# Altium project 24bit_ADC_ADS1234.PrjPcb
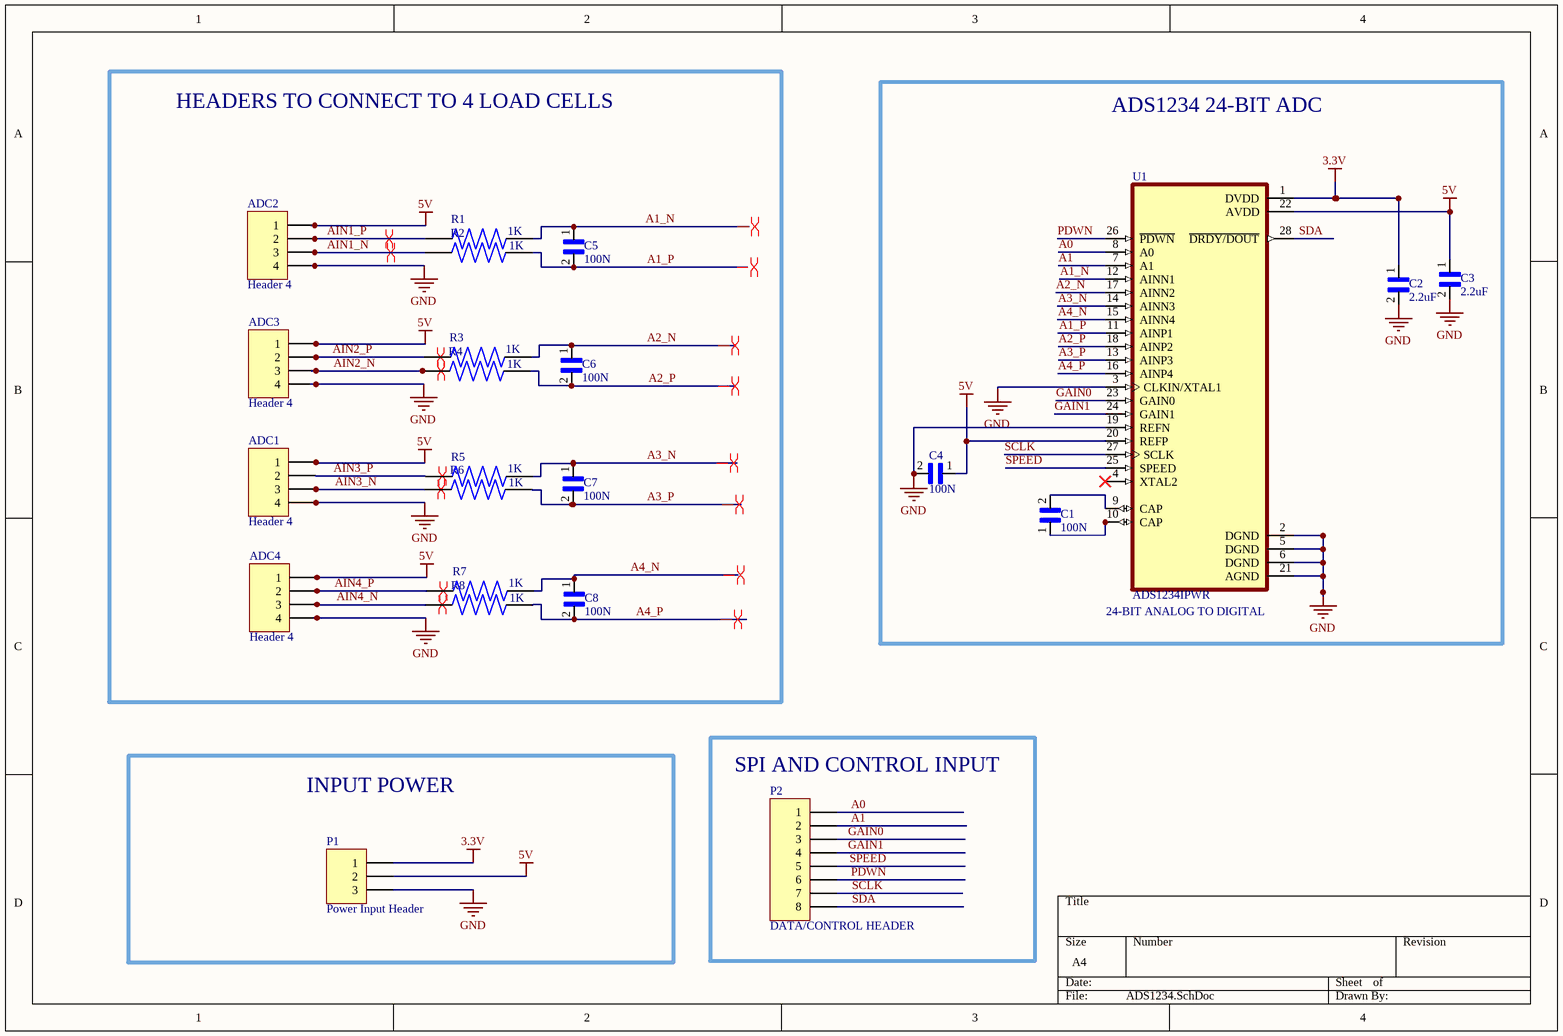
[diagram p0: ADS1234.SchDoc]
1 sheet, 23 parts. Net scope: global (net labels, ports and power ports of the same name join across sheets).
Board file: ADS1234.PcbDoc

## Sheet ADS1234.SchDoc
size A4; SheetNumber: 1; SheetTotal: 1

### Parts
ADC1  Header 4  [HDR1X4]
ADC2  Header 4  [HDR1X4]
ADC3  Header 4  [HDR1X4]
ADC4  Header 4  [HDR1X4]
C1  100N  [CAPC1005X55N]
C2  2.2uF  [CAPC1608X100N]
C3  2.2uF  [CAPC1608X100N]
C4  100N  [CAPC1005X55N]
C5  100N  [CAPC1005X55N]
C6  100N  [CAPC1005X55N]
C7  100N  [CAPC1005X55N]
C8  100N  [CAPC1005X55N]
P1  Power Input Header  [HDR1X3]
P2  DATA/CONTROL HEADER  [HDR1X8]
R1  1K  [RESC2012X50N]
R2  1K  [RESC2012X50N]
R3  1K  [RESC2012X50N]
R4  1K  [RESC2012X50N]
R5  1K  [RESC2012X50N]
R6  1K  [RESC2012X50N]
R7  1K  [RESC2012X50N]
R8  1K  [RESC2012X50N]
U1  ADS1234IPWR  [SOP65P640X120-28N]

### Blocks framed on the sheet
HEADERS TO CONNECT TO 4 LOAD CELLS: ADC1-ADC4 C5-C8 R1-R8
ADS1234 24-BIT ADC: C1-C4 U1
INPUT POWER: P1
SPI AND CONTROL INPUT: P2

### Nets
3.3V: C2.1 P1.1 U1.1(DVDD)
5V: ADC1.1 ADC2.1 ADC3.1 ADC4.1 C3.1 C4.1 P1.2 U1.20(REFP) U1.22(AVDD)
GND: ADC1.4 ADC2.4 ADC3.4 ADC4.4 C2.2 C3.2 C4.2 P1.3 U1.2(DGND) U1.3(CLKIN/XTAL1) U1.5(DGND) U1.6(DGND) U1.19(REFN) U1.21(AGND)
A0: P2.1 U1.8(A0)
A1: P2.2 U1.7(A1)
A1_N: C5.1 R1.2 U1.12(AINN1)
A1_P: C5.2 R2.2 U1.11(AINP1)
A2_N: C6.1 R3.2 U1.17(AINN2)
A2_P: C6.2 R4.2 U1.18(AINP2)
A3_N: C7.1 R5.2 U1.14(AINN3)
A3_P: C7.2 R6.2 U1.13(AINP3)
A4_N: C8.1 R7.2 U1.15(AINN4)
A4_P: C8.2 R8.2 U1.16(AINP4)
AIN1_N: ADC2.3 R2.1
AIN1_P: ADC2.2 R1.1
AIN2_N: ADC3.3 R4.1
AIN2_P: ADC3.2 R3.1
AIN3_N: ADC1.3 R6.1
AIN3_P: ADC1.2 R5.1
AIN4_N: ADC4.3 R8.1
AIN4_P: ADC4.2 R7.1
GAIN0: P2.3 U1.23(GAIN0)
GAIN1: P2.4 U1.24(GAIN1)
PDWN: P2.6 U1.26(~{PDWN})
SCLK: P2.7 U1.27(SCLK)
SDA: P2.8 U1.28(~{DRDY/DOUT})
SPEED: P2.5 U1.25(SPEED)
NetC1_1: C1.1 U1.10(CAP)
NetC1_2: C1.2 U1.9(CAP)

Not connected (* = marked no-connect by the designer): U1 4(XTAL2)*

### Layout directives
differential pair: A1_N, A1_P, A2_N, A2_P, A3_N, A3_P, A4_N, A4_P, AIN1_N, AIN1_P, AIN2_N, AIN2_P, AIN3_N, AIN3_P, AIN4_N, AIN4_P

### Notes on the sheet
- (near U1) 24-BIT ANALOG TO DIGITAL

### Library data of the parts
ADC1-ADC4 = Header 4: Header, 4-Pin; LatestRevisionDate: 17-Jul-2002; LatestRevisionNote: Re-released for DXP Platform.; Publisher: Altium Limited
C1 C4-C8 = GRM155R71C104KA88D: SMD Capacitor X7R_EIA_ with Capacitance: 0.10uF Tol. 10%. Rated Voltage: 16Vdc; MF: Murata; Package: 1005 Taiyo Yuden; Value: *; MP: GRM155R71C104KA88D; SnapEDA_Link: https://www.snapeda.com/parts/GRM155R71C104KA88D/Murata%20Electronics%20North%20America/view-part/4750/?ref=snap
C2 C3 = GRM188R61H225ME11D: Package: None; Price: None; Value: *; MP: GRM188R61H225ME11D; Availability: Unavailable
P1 = Header 3: Header, 3-Pin; LatestRevisionDate: 17-Jul-2002; LatestRevisionNote: Re-released for DXP Platform.; Publisher: Altium Limited
P2 = Header 8: Header, 8-Pin; LatestRevisionDate: 17-Jul-2002; LatestRevisionNote: Re-released for DXP Platform.; Publisher: Altium Limited
R1-R8 = CRCW08051K00DHEAP: Package: None; Price: None; Value: *; MP: CRCW08051K00DHEAP; Availability: Unavailable
U1 = ADS1234IPWR: Package: None; Price: None; Value: *; MP: ADS1234IPWR; Availability: Unavailable